# Altium schematic sheet address_detector.SchDoc
size A3
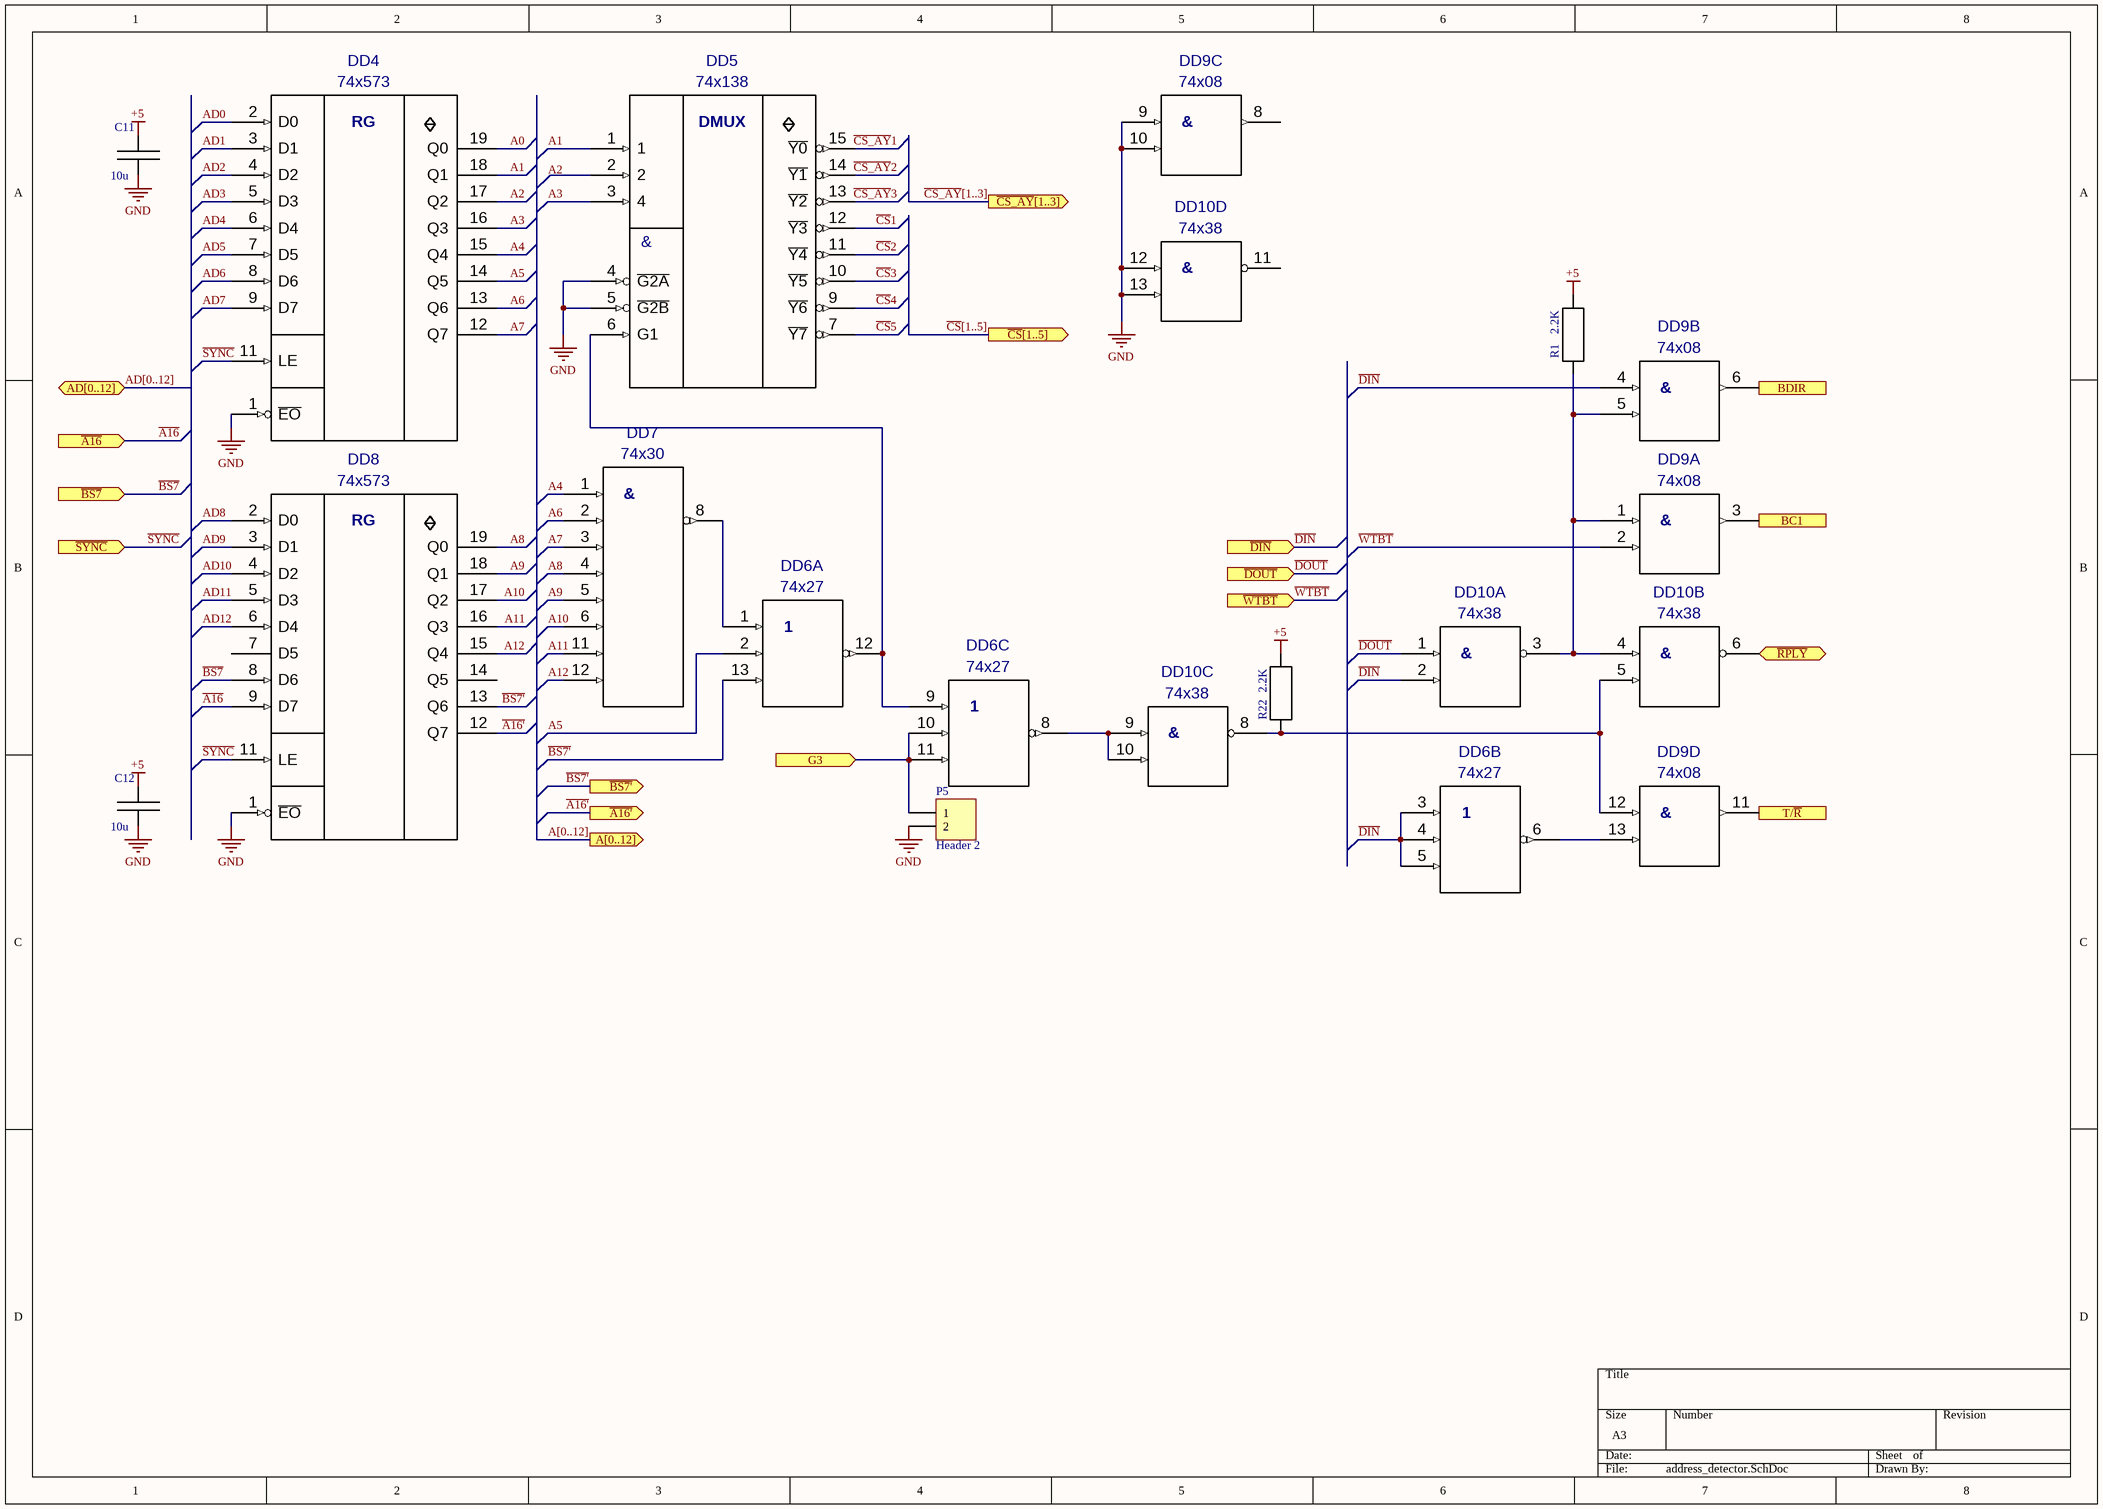
[diagram p0: address_detector.SchDoc]

## Parts
C11  10u  [CAP 5.5x3.15]
C12  10u  [CAP 5.5x3.15]
DD4  74x573  [DIP20]
DD5  74x138  [DIP16]
DD6  74x27  [DIP14]  (parts A,B,C of 3)
DD7  74x30  [DIP14]
DD8  74x573  [DIP20]
DD9  74x08  [DIP14]  (parts A,B,C,D of 4)
DD10  74x38  [DIP14]  (parts A,B,C,D of 4)
P5  Header 2  [HDR1X2]
R1  2.2K  [Axial Res 0.25]
R22  2.2K  [Axial Res 0.25]

## Ports
A[0..12] (out), AD[0..12] (bidir), BC1 (out), BDIR (out), G3 (in), T/~{R} (out), ~{A16'} (out), ~{A16} (in), ~{BS7'} (out), ~{BS7} (in), ~{CS_AY}[1..3] (out), ~{CS}[1..5] (out), ~{DIN} (in), ~{DOUT} (in), ~{RPLY} (bidir), ~{SYNC} (in), ~{WTBT} (in)

## Nets
+5: C11.2 C12.2 DD4.20(+5V) DD5.16(+5) DD6.14(+5V) DD7.14(+5) DD8.20(+5V) DD9.14(+5V) DD10.14(+5) R1.?2 R22.?2
GND: C11.1 C12.1 DD4.1(~{EO}) DD4.10(GND) DD5.4(~{G2A}) DD5.5(~{G2B}) DD5.8(GND) DD6.7(GND) DD7.7(GND) DD8.1(~{EO}) DD8.10(GND) DD9.7(GND) DD9.9 DD9.10 DD10.7(GND) DD10.12 DD10.13 P5.2
A0: DD4.19(Q0)
A1: DD4.18(Q1) DD5.1
A2: DD4.17(Q2) DD5.2
A3: DD4.16(Q3) DD5.3(4)
A4: DD4.15(Q4) DD7.1
A5: DD4.14(Q5) DD6.2
A6: DD4.13(Q6) DD7.2
A7: DD4.12(Q7) DD7.3
A8: DD7.4 DD8.19(Q0)
A9: DD7.5 DD8.18(Q1)
A10: DD7.6 DD8.17(Q2)
A11: DD7.11 DD8.16(Q3)
A12: DD7.12 DD8.15(Q4)
~{A16}: DD8.9(D7) ; port ~{A16}
~{A16'}: DD8.12(Q7) ; port ~{A16'}
AD0: DD4.2(D0)
AD1: DD4.3(D1)
AD2: DD4.4(D2)
AD3: DD4.5(D3)
AD4: DD4.6(D4)
AD5: DD4.7(D5)
AD6: DD4.8(D6)
AD7: DD4.9(D7)
AD8: DD8.2(D0)
AD9: DD8.3(D1)
AD10: DD8.4(D2)
AD11: DD8.5(D3)
AD12: DD8.6(D4)
~{BS7}: DD8.8(D6) ; port ~{BS7}
~{BS7'}: DD6.13 DD8.13(Q6) ; port ~{BS7'}
BC1: DD9.3 ; port BC1
BDIR: DD9.6 ; port BDIR
~{CS}1: DD5.12(~{Y3})
~{CS}2: DD5.11(~{Y4})
~{CS}3: DD5.10(~{Y5})
~{CS}4: DD5.9(~{Y6})
~{CS}5: DD5.7(~{Y7})
~{CS_AY}1: DD5.15(~{Y0})
~{CS_AY}2: DD5.14(~{Y1})
~{CS_AY}3: DD5.13(~{Y2})
~{DIN}: DD6.3 DD6.4 DD6.5 DD9.4 DD10.2 ; port ~{DIN}
~{DOUT}: DD10.1 ; port ~{DOUT}
G3: DD6.10 DD6.11 P5.1 ; port G3
~{RPLY}: DD10.6 ; port ~{RPLY}
~{SYNC}: DD4.11(LE) DD8.11(LE) ; port ~{SYNC}
T/~{R}: DD9.11 ; port T/~{R}
~{WTBT}: DD9.2 ; port ~{WTBT}
NetDD5_6: DD5.6(G1) DD6.9 DD6.12
NetDD6_1: DD6.1 DD7.8
NetDD6_6: DD6.6 DD9.13
NetDD6_8: DD6.8 DD10.9 DD10.10
NetDD9_1: DD9.1 DD9.5 DD10.3 DD10.4 R1.?1
NetDD9_12: DD9.12 DD10.5 DD10.8 R22.?1

Not connected (* = marked no-connect by the designer): DD8 7(D5) 14(Q5); DD9 8; DD10 11

## Buses and harness runs
bus A[0..12] = port A[0..12]
bus AD[0..12] = port AD[0..12]
bus ~{CS_AY}[1..3] = port ~{CS_AY}[1..3]
bus ~{CS}[1..5] = port ~{CS}[1..5]

## Notes on the sheet
- (in symbol 74x08, part A) &
- (in symbol 74x08, part B) &
- (in symbol 74x08, part C) &
- (in symbol 74x08, part D) &
- (in symbol 74x30) &
- (in symbol 74x38, part A) &
- (in symbol 74x38, part B) &
- (in symbol 74x38, part C) &
- (in symbol 74x38, part D) &
- (in symbol 74x138) DMUX; &
- (in symbol 74x573) RG

## Library data of the parts
C11 C12 = Cap: Murata ceramic capacitor
DD4 DD8 = 74x573: ИР22 transparent latch; Value: *
DD5 = 74x138: ИД7 3 to 8 DEMUX; Value: *
DD6 = 74x27: ЛЕ4 3x3NOR; Value: *
DD7 = 74x30: ЛА2 8NAND; Value: *
DD9 = 74x08: ЛИ1 4x2AND; Value: *
DD10 = 74x38: ЛА13 4x2NAND O.C.; Value: *
P5 = Header 2: Header, 2-Pin; LatestRevisionDate: 17-Jul-2002; LatestRevisionNote: Re-released for DXP Platform.; Publisher: Altium Limited
R1 R22 = Axial Resistor 0.25